# Altium schematic sheet MPPT-v2.schdoc: =ProjectName
size A4; CheckedBy: DatNB; Author: Ven; CompanyName: Nacentech; Organization: IMET
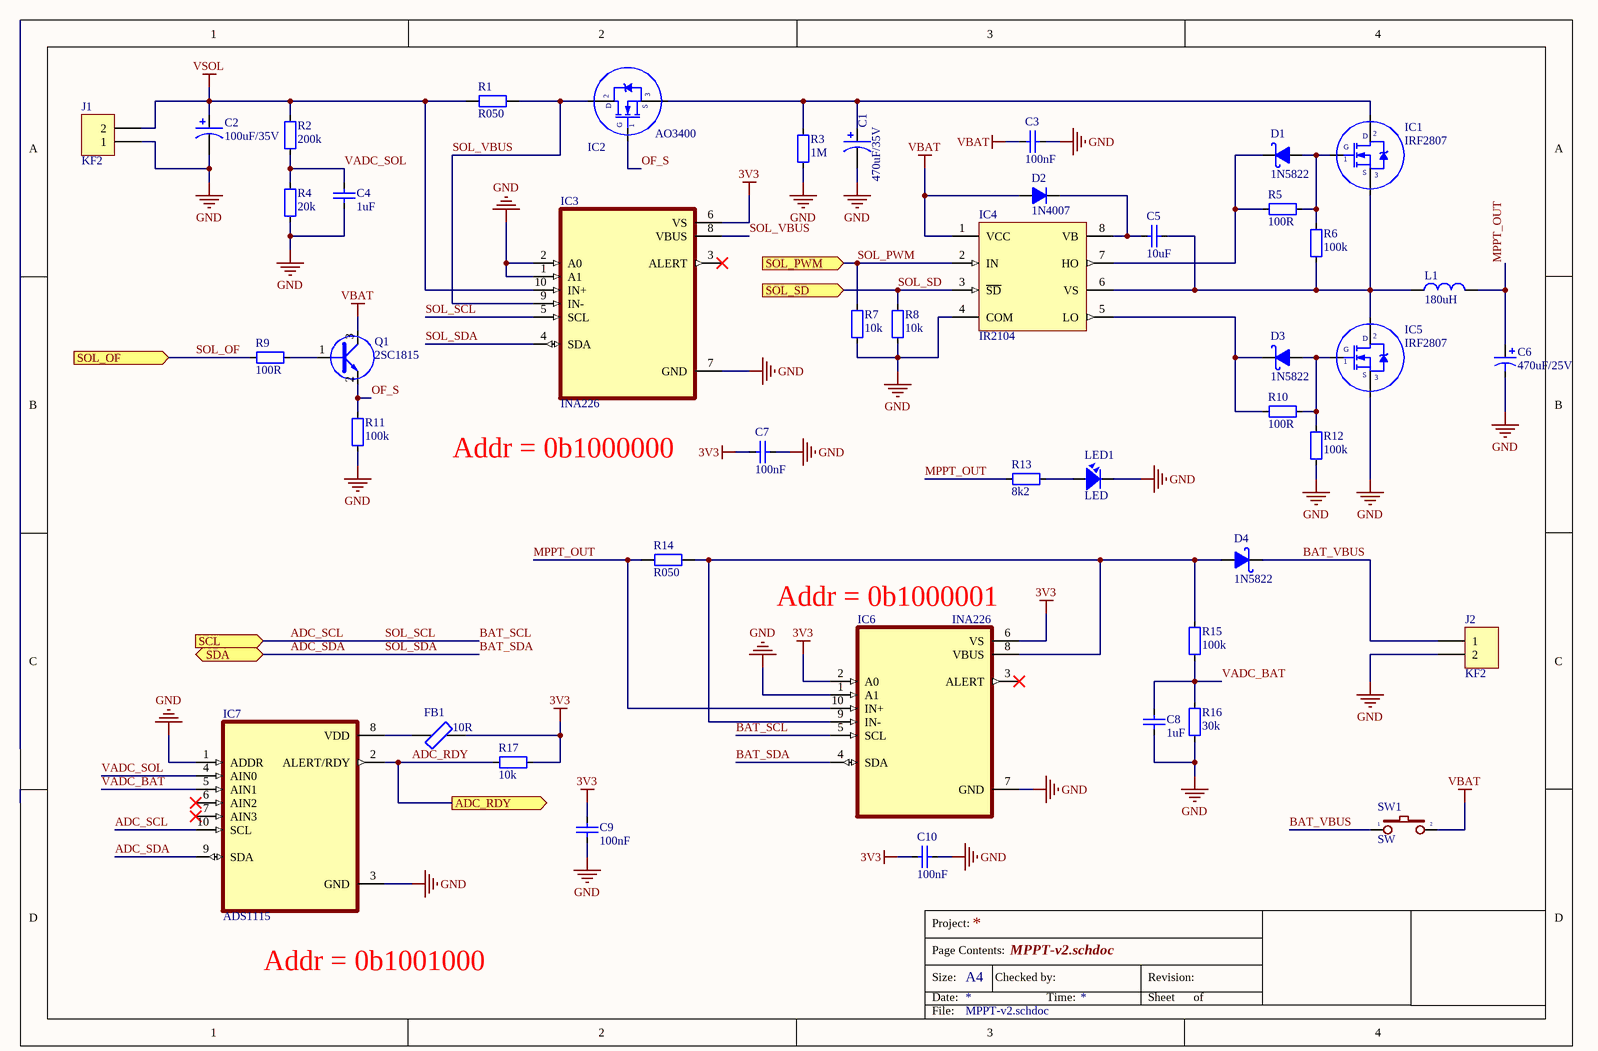
[diagram p0: MPPT-v2.schdoc]

## Parts
C1  470uF/35V  [CAP_H17_D10]
C2  100uF/35V  [CAP_H12_D06]
C3  100nF  [CAP_0805]
C4  1uF  [CAP_0805]
C5  10uF  [CAP_0805]
C6  470uF/25V  [C8mm]
C7  100nF  [CAP_0805]
C8  1uF  [CAP_0805]
C9  100nF  [CAP_0805]
C10  100nF  [CAP_0805]
D1  1N5822  [DIO-214AC(SMA)]
D2  1N4007  [DIO-214AC(SMA)]
D3  1N5822  [DIO-214AC(SMA)]
D4  1N5822  [DIO-214AC(SMA)]
FB1  10R  [RES-SMD-0805]
IC1  IRF2807  [TO-220]
IC2  AO3400  [SOT23A]
IC3  INA226  [VSSOP-10]
IC4  IR2104  [SOP-8]
IC5  IRF2807  [TO-220]
IC6  INA226  [VSSOP-10]
IC7  ADS1115  [VSSOP-10]
J1  KF2  [KF2-5.08]
J2  KF2  [KF2-5.08]
L1  180uH  [L-DIP-M-13.5x6]
LED1  LED  [LED-0805-Red]
Q1  2SC1815  [SOT23D]
R1  R050  [RES-SMD-2512]
R2  200k  [RES-SMD-0805]
R3  1M  [RES-SMD-0805]
R4  20k  [RES-SMD-0805]
R5  100R  [RES-SMD-0805]
R6  100k  [RES-SMD-0805]
R7  10k  [RES-SMD-0805]
R8  10k  [RES-SMD-0805]
R9  100R  [RES-SMD-0805]
R10  100R  [RES-SMD-0805]
R11  100k  [RES-SMD-0805]
R12  100k  [RES-SMD-0805]
R13  8k2  [RES-SMD-0805]
R14  R050  [RES-SMD-2512]
R15  100k  [RES-SMD-0805]
R16  30k  [RES-SMD-0805]
R17  10k  [RES-SMD-0805]
SW1  SW  [SW2]

## Ports
ADC_RDY (out), SCL (in), SDA (bidir), SOL_OF (in), SOL_PWM (in), SOL_SD (in)

## Nets
3V3: C7.1 C9.1 C10.1 FB1.2 IC3.6(VS) IC6.2(A0) IC6.6(VS) R17.1
GND: C1.2 C2.2 C3.2 C4.2 C6.2 C7.2 C8.2 C9.2 C10.2 IC3.1(A1) IC3.2(A0) IC3.7(GND) IC4.4(COM) IC5.3(S) IC6.1(A1) IC6.7(GND) IC7.1(ADDR) IC7.3(GND) J1.1 J2.2 LED1.2 R3.1 R4.2 R7.1 R8.1 R11.2 R12.2 R16.2
VBAT: C3.1 D2.1(A) IC4.1(VCC) Q1.3(C) SW1.2
VSOL: C2.1 IC3.10(IN+) J1.2 R1.2 R2.2
ADC_RDY: IC7.2(ALERT/RDY) R17.2 ; port ADC_RDY
ADC_SCL: IC3.5(SCL) IC6.5(SCL) IC7.10(SCL) ; port SCL  [also labelled BAT_SCL, SOL_SCL]
ADC_SDA: IC3.4(SDA) IC6.4(SDA) IC7.9(SDA) ; port SDA  [also labelled BAT_SDA, SOL_SDA]
BAT_VBUS: D4.2(K) J2.1 SW1.1
MPPT_OUT: C6.1 IC6.10(IN+) L1.2 R13.1 R14.2
OF_S: IC2.1(G) Q1.2(E) R11.1
SOL_OF: R9.2 ; port SOL_OF
SOL_PWM: IC4.2(IN) R7.2 ; port SOL_PWM
SOL_SD: IC4.3(~{SD}) R8.2 ; port SOL_SD
SOL_VBUS: IC2.2(D) IC3.8(VBUS) IC3.9(IN-) R1.1
VADC_BAT: C8.1 IC7.5(AIN1) R15.2 R16.1
VADC_SOL: C4.1 IC7.4(AIN0) R2.1 R4.1
NetC1_1: C1.1 IC1.2(D) IC2.3(S) R3.2
NetC5_1: C5.1 D2.2(K) IC4.8(VB)
NetC5_2: C5.2 IC1.3(S) IC4.6(VS) IC5.2(D) L1.1 R6.2
NetD1_1: D1.1(A) IC1.1(G) R5.1 R6.1
NetD1_2: D1.2(K) IC4.7(HO) R5.2
NetD3_1: D3.1(A) IC5.1(G) R10.1 R12.1
NetD3_2: D3.2(K) IC4.5(LO) R10.2
NetD4_1: D4.1(A) IC6.8(VBUS) IC6.9(IN-) R14.1 R15.1
NetFB1_1: FB1.1 IC7.8(VDD)
NetLED1_1: LED1.1 R13.2
NetQ1_1: Q1.1(B) R9.1

Not connected (* = marked no-connect by the designer): IC3 3(ALERT)*; IC6 3(ALERT)*; IC7 6(AIN2)* 7(AIN3)*

## Notes on the sheet
- Addr = 0b1000000
- (near IC6) Addr = 0b1000001
- Addr = 0b1001000
- Project:
- Page Contents:
- Size:
- Date:
- A4
- Checked by:
- Time:
- Revision:
- Sheet
- of
- File:

## Library data of the parts
C1 C2 C6 = Cap Pol: Polarized Capacitor (Axial); Published: 8-Jun-2000; LatestRevisionDate: 17-Jul-2002; LatestRevisionNote: Re-released for DXP Platform.; PackageReference: POLAR0.8; Publisher: Altium Limited
C3-C5 C7-C10 = CapSMD: Capacitor; Value: 33p; Published: 8-Jun-2000; LatestRevisionDate: 17-Jul-2002; LatestRevisionNote: Re-released for DXP Platform.; PackageReference: RAD-0.3; Publisher: Altium Limited
D1 D3 D4 = 1N5822: Schottky Rectifiers; Value: Diode c?m 1N5408
D2 = D1A: Diode 1A; Value: 1N4007
FB1 = Ferrit Bead: Generic Ferrit Bead
IC1 IC2 IC5 = MOSFET_N: Generic N Channel MOSFET
IC3 IC6 = INA226: Current Sensing IC
IC4 = IR2104: PWM Driver
IC7 = ADS1115: 16 bits 4 channals ADC IC
J1 J2 = KF2: Manufacturer: Würth Elektronik eiSos GmbH; partNo: 691103110002; ComponentLink1 Description: Manufacturer; ComponentLink2 Description: Datasheet; NoPins: 2; Created Date: 29 October 2013; ComponentLink1URL: http://www.we-online.com; ComponentLink2URL: http://katalog.we-online.de/em/datasheet/6911031100xx.pdf; Created by: Karrer Zheng
L1 = Inductor: 180uH 4A 13mm; Value: 150 mH
LED1 = LED: LED Single colour Green and Red; Value: LED 3 ly Single Colour
Q1 = C1815: NPN 600mW, ECB; Value: C1815
R1 R14 = Resistor - SMD: Resistor SMD; Manufacturer: Generic Components; Class: Passive; Published: 08/06/2000; Publisher: Altium Hobart Technology Centre
R2-R13 R15-R17 = Resistor - SMD: Resistor; Manufacturer: Generic Components; Class: Passive; Published: 08/06/2000; Publisher: Altium Hobart Technology Centre
SW1 = SW2: Switch button 2 pin; Value: SW chip 2 pin